# Altium schematic sheet Drone.SchDoc
size A3; SheetNumber: 2; SheetTotal: 1
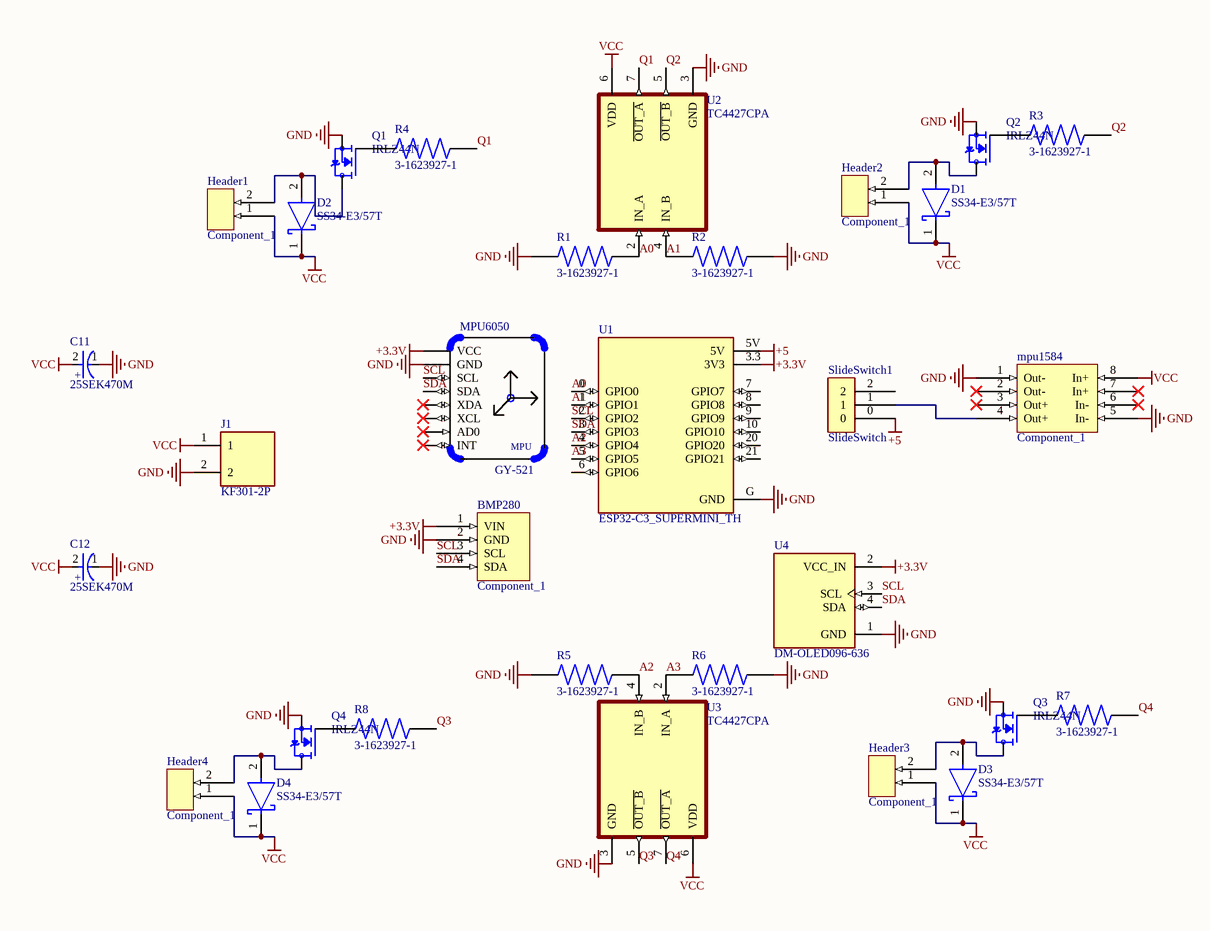
[diagram p0: Drone.SchDoc]

## Parts
BMP280  Component_1  [PCBComponent_1]
C11  25SEK470M  [FP-OS-CON-TH-F13-d_0_6-MFG]
C12  25SEK470M  [FP-OS-CON-TH-F13-d_0_6-MFG]
D1  SS34-E3/57T  [FP-95402-MFG]
D2  SS34-E3/57T  [FP-95402-MFG]
D3  SS34-E3/57T  [FP-95402-MFG]
D4  SS34-E3/57T  [FP-95402-MFG]
Header1  Component_1  [1X2P]
Header2  Component_1  [1X2P]
Header3  Component_1  [1X2P]
Header4  Component_1  [1X2P]
J1  KF301-2P  [HANDSON_KF301-2P]
mpu1584  Component_1  [PCBComponent_1]
MPU6050  GY-521  [*GY-521_GY-521(Primary)]
Q1  IRLZ44N  [TO254P1054X469X1930-3]
Q2  IRLZ44N  [TO254P1054X469X1930-3]
Q3  IRLZ44N  [TO254P1054X469X1930-3]
Q4  IRLZ44N  [TO254P1054X469X1930-3]
R1  3-1623927-1  [RESAD700W45L350D185]
R2  3-1623927-1  [RESAD700W45L350D185]
R3  3-1623927-1  [RESAD700W45L350D185]
R4  3-1623927-1  [RESAD700W45L350D185]
R5  3-1623927-1  [RESAD700W45L350D185]
R6  3-1623927-1  [RESAD700W45L350D185]
R7  3-1623927-1  [RESAD700W45L350D185]
R8  3-1623927-1  [RESAD700W45L350D185]
SlideSwitch1  SlideSwitch  [PCBComponent_1]
U1  ESP32-C3_SUPERMINI_TH  [MODULE_ESP32-C3_SUPERMINI_TH]
U2  TC4427CPA  [DIP794W46P254L978H432Q8]
U3  TC4427CPA  [DIP794W46P254L978H432Q8]
U4  DM-OLED096-636  [MODULE_DM-OLED096-636]

## Nets
+3.3V: BMP280.1(VIN) MPU6050.VCC U1.3.3(3V3) U4.2(VCC_IN)
+5: SlideSwitch1.0 U1.5V
GND: BMP280.2(GND) C11.1(C) C12.1(C) J1.2 mpu1584.1(Out-) mpu1584.5(In-) MPU6050.GND Q1.3(S) Q2.3(S) Q3.3(S) Q4.3(S) R1.1 R2.2 R5.1 R6.2 U1.G(GND) U2.3(GND) U3.3(GND) U4.1(GND)
VCC: C11.2(A) C12.2(A) D1.1(C) D2.1(C) D3.1(C) D4.1(C) Header1.1 Header2.1 Header3.1 Header4.1 J1.1 mpu1584.8(In+) U2.6(VDD) U3.6(VDD)
A0: R1.2 U1.0(GPIO0) U2.2(IN_A)
A1: R2.1 U1.1(GPIO1) U2.4(IN_B)
A2: R5.2 U1.4(GPIO4) U3.4(IN_B)
A3: R6.1 U1.5(GPIO5) U3.2(IN_A)
Q1: R4.2 U2.7(~{OUT_A})
Q2: R3.2 U2.5(~{OUT_B})
Q3: R8.2 U3.5(~{OUT_B})
Q4: R7.2 U3.7(~{OUT_A})
SCL: BMP280.3(SCL) MPU6050.SCL U1.2(GPIO2) U4.3(SCL)
SDA: BMP280.4(SDA) MPU6050.SDA U1.3(GPIO3) U4.4(SDA)
NetD1_2: D1.2(A) Header2.2 Q2.2(D)
NetD2_2: D2.2(A) Header1.2 Q1.2(D)
NetD3_2: D3.2(A) Header3.2 Q3.2(D)
NetD4_2: D4.2(A) Header4.2 Q4.2(D)
Netmpu1584_4: mpu1584.4(Out+) SlideSwitch1.1
NetQ1_1: Q1.1(G) R4.1
NetQ2_1: Q2.1(G) R3.1
NetQ3_1: Q3.1(G) R7.1
NetQ4_1: Q4.1(G) R8.1

Not connected (* = marked no-connect by the designer): mpu1584 2(Out-)* 3(Out+)* 6(In-)* 7(In+)*; MPU6050 AD0* INT* XCL* XDA*; SlideSwitch1 2; U1 6(GPIO6) 7(GPIO7) 8(GPIO8) 9(GPIO9) 10(GPIO10) 20(GPIO20) 21(GPIO21)

## Notes on the sheet
- (in symbol CMP-05428-000411-1) +
- (in symbol GY-521) MPU

## Library data of the parts
C11 C12 = CMP-05428-000411-1: Conductive Polymer Aluminum Solid Capacitors (OS-CON) 470uF ±20% 25V RADIAL TH 10x13mm; RoHS Compliant: Yes
D1-D4 = CMP-02539-000012-1: DIODE SCHOTTKY 40V 3A DO214AB; Manufacturer: Vishay; Max Junction Temp: +150°C; Peak Reverse Current: 0.5mA; Max Surge Forward Current: 100A; Standoff Height: 0mm; ComponentLink2Description: Datasheet; Device Class L3: Schottky Diodes; Height: 2.62mm; Max Repetitive Reverse Voltage: 40V; Lead Free: Yes; Package: 95402; Temperature Range High: +150°C; ComponentLink2URL: http://www.vishay.com/docs/88751/ss32.pdf; Temperature: -55°C to +150°C; Footprint Url: http://www.vishay.com/docs/95402/smc.pdf; Automotive: No; Forward Current: 3A; Category: Diode; Manufacturer Part Number: SS34-E3/57T; RoHS: TRUE; Device Class L2: Diodes; Mouser Description: Schottky Diodes & Rectifiers 3.0 Amp 40 Volt; Octopart: https://octopart.com/ss34-e3%2F57t-vishay-39552907; Temperature Range Low: -55°C; Device Class L1: Discrete Semiconductors; Digikey Description: DIODE SCHOTTKY 40V 3A DO214AB
J1 = KF301-2P: 2 Pin Terminal Block 5mm Pitch; MF: Handson Technology; SnapEDA_Link: https://www.snapeda.com/parts/KF301-2P/Handson+Technology/view-part/?ref=snap; Package: None; Value: *; MP: KF301-2P; Check_prices: https://www.snapeda.com/parts/KF301-2P/Handson+Technology/view-part/?ref=eda
MPU6050 = GY-521: Triple Axis Accelerometer Gyro Breakout; MF: GODREAM FORDREAM CO., LIMITED; SnapEDA_Link: https://www.snapeda.com/parts/GY-521/GODREAM+FORDREAM+CO.%252C+LIMITED/view-part/?ref=snap; Package: Package; MP: GY-521; Check_prices: https://www.snapeda.com/parts/GY-521/GODREAM+FORDREAM+CO.%252C+LIMITED/view-part/?ref=eda; Value: *
Q1-Q4 = IRLZ44N: N-Channel 55 V 47A (Tc) 3.8W (Ta), 110W (Tc) Surface Mount D2PAK; MF: Infineon / IR; Package: TO-220-3 Infineon / IR; Availability: Not in stock; Value: *; MP: IRLZ44N; Check_prices: https://www.snapeda.com/parts/IRLZ44N/Infineon/view-part/?ref=eda; Price: None; SnapEDA_Link: https://www.snapeda.com/parts/IRLZ44N/Infineon/view-part/?ref=snap
R1-R8 = 3-1623927-1: 1 MOhms Â±5% 0.25W, 1/4W Through Hole Resistor Axial - Carbon Film; MF: TE Connectivity; SnapEDA_Link: https://www.snapeda.com/parts/3-1623927-1/TE+Connectivity/view-part/?ref=snap; Package: None; Value: *; MP: 3-1623927-1; Check_prices: https://www.snapeda.com/parts/3-1623927-1/TE+Connectivity/view-part/?ref=eda
U1 = ESP32-C3_SUPERMINI_TH: Super tiny ESP32-C3 board; MF: Espressif Systems; MP: ESP32-C3 SuperMini_TH; SnapEDA_Link: https://www.snapeda.com/parts/ESP32-C3%20SuperMini_TH/Espressif+Systems/view-part/?ref=snap; Package: Package; Value: *; Check_prices: https://www.snapeda.com/parts/ESP32-C3%20SuperMini_TH/Espressif+Systems/view-part/?ref=eda
U2 U3 = TC4427CPA: TC4427CPA,Dual MOSFET Power Driver 1.5A,4.5 to 18V,Non-Inverting,8-Pin PDIP | Microchip Technology Inc. TC4427CPA; SnapEDA_Link: https://www.snapeda.com/parts/TC4427CPA/Microchip+Technology/view-part/?ref=snap; Package: DIP-8 Microchip; Value: *; MF: Microchip Technology; MP: TC4427CPA; Check_prices: https://www.snapeda.com/parts/TC4427CPA/Microchip+Technology/view-part/?ref=eda
U4 = DM-OLED096-636: 0.96â€ 128 X 64 MONOCHROME GRAPHIC OLED DISPLAY MODULE - I2C; SnapEDA_Link: https://www.snapeda.com/parts/DM-OLED096-636/Display+Module/view-part/?ref=snap; Package: Package; Value: *; MF: Display Module; MP: DM-OLED096-636; Check_prices: https://www.snapeda.com/parts/DM-OLED096-636/Display+Module/view-part/?ref=eda